# EAGLE design stepper-v1.1 (EAGLE 6.4)
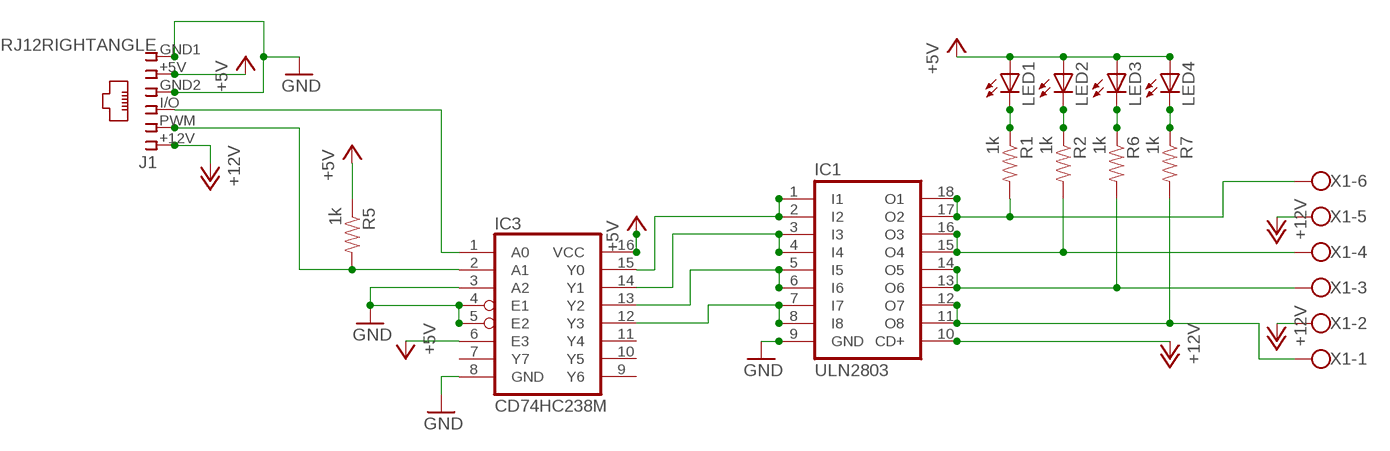
[diagram p0: schematic, sheet 1]

## Parts
IC1  ULN2803  ULN2803A  [SO18W]
IC3  CD74HC238M  74238D  [SO16]
J1  RJ12RIGHTANGLE  [RJ12-RIGHTANGLE]
LED1  LED3MM  [LED3MM]
LED2  LED3MM  [LED3MM]
LED3  LED3MM  [LED3MM]
LED4  LED3MM  [LED3MM]
R1  1k  RESISTOR1206  [1206]
R2  1k  RESISTOR1206  [1206]
R5  1k  RESISTOR1206  [1206]
R6  1k  RESISTOR1206  [1206]
R7  1k  RESISTOR1206  [1206]
X1  W237-6  [W237-6]

## Nets
+5V [power]: IC3.6(E3) IC3.16(VCC) J1.+5V LED1.A LED2.A LED3.A LED4.A R5.1
+12V [power]: IC1.10(CD+) J1.+12V X1.2 X1.5
GND [power]: IC1.9(GND) IC3.3(A2) IC3.4(E1) IC3.5(E2) IC3.8(GND) J1.GND1 J1.GND2
N$1: IC1.1(I1) IC1.2(I2) IC3.15(Y0)
N$2: IC3.2(A1) J1.PWM R5.2
N$3 [power]: IC1.17(O2) IC1.18(O1) R1.2 X1.6
N$4 [power]: IC1.15(O4) IC1.16(O3) R2.2 X1.4
N$5 [power]: IC1.13(O6) IC1.14(O5) R6.2 X1.3
N$6 [power]: IC1.11(O8) IC1.12(O7) R7.2 X1.1
N$7: IC1.7(I7) IC1.8(I8) IC3.12(Y3)
N$8: IC1.3(I3) IC1.4(I4) IC3.14(Y1)
N$9: LED1.K(C) R1.1
N$10: LED2.K(C) R2.1
N$11: LED3.K(C) R6.1
N$12: LED4.K(C) R7.1
N$13: IC3.1(A0) J1.I/O
N$14: IC1.5(I5) IC1.6(I6) IC3.13(Y2)
Unconnected: IC3.7(Y7) IC3.9(Y6) IC3.10(Y5) IC3.11(Y4)

## Library data of the parts
IC1 = lpatiny:ULN2803A: DRIVER ARRAY
IC3 = lpatiny:74*238: 3 to 8 line DECODER/DEMULTIPLEXER
J1 = lpatiny:RJ12: CORCOM Modular RJ Jacks No Shield Source: www.tycoelectronics.com .. ENG_DS_1654001_1099_RJ_L_0507.pdf
LED1-LED4 = lpatiny:LED3MM
R1 R2 R5-R7 = SparkFun:RESISTOR: Resistor Basic schematic elements and footprints for 0603, 1206, and PTH resistors.
X1 = con-wago-500:W237-6: WAGO SCREW CLAMP; OC_FARNELL: unknown; OC_NEWARK: unknown

## Net classes
0 default: width 0.356 mm
1 power: width 0.61 mm

## Board
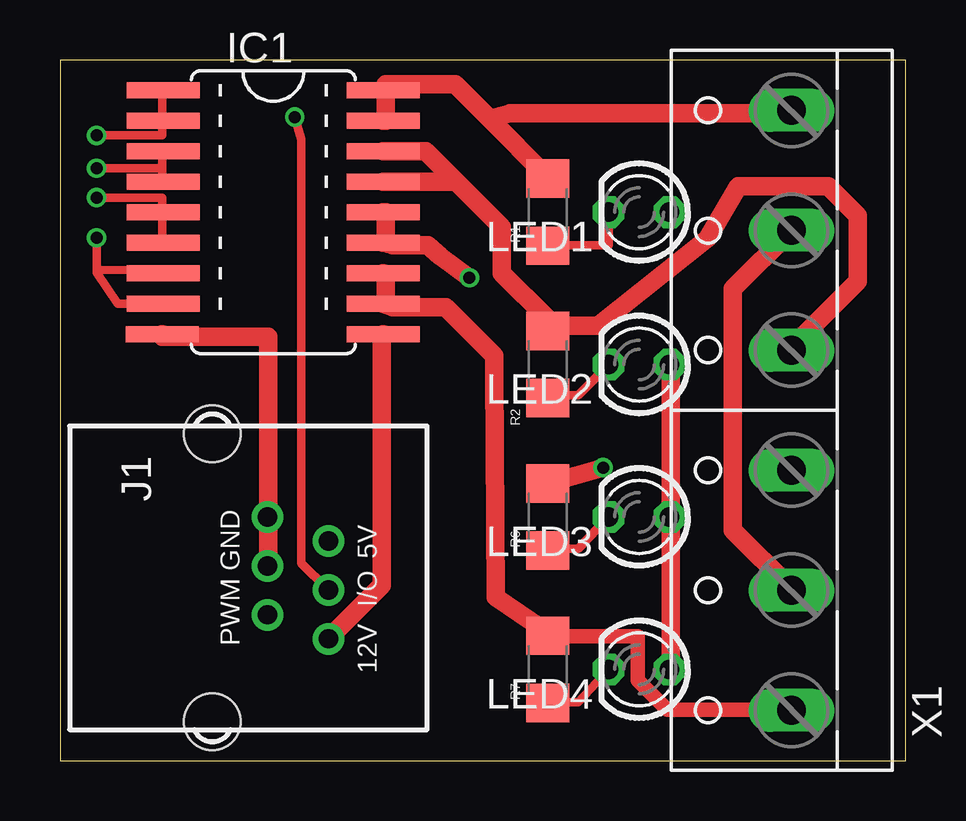
[diagram p1: board, top side]
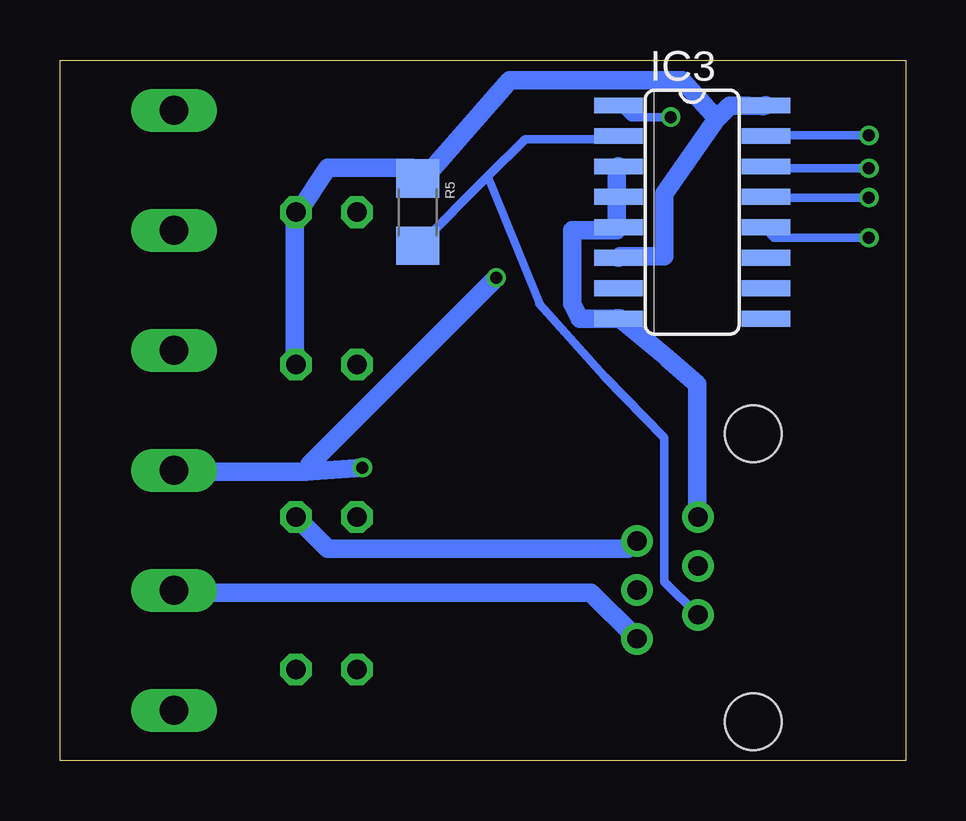
[diagram p2: board, bottom side, seen from below]

Size 35.23 x 29.2 mm. Coordinates in mm from the lower left corner, seen from the top.
Outline: 0,0 35.23,0 35.23,29.2 0,29.2 0,0
Copper layers (1*16): Top 0.035mm / dielectric 1.5mm / Bottom 0.035mm
Design rules "Fusion_eagle_rule_v1.1": minimum track width 6mil, minimum drill 12mil, track to track 6mil, track to pad 6mil, pad to pad 6mil, via to via 6mil, smd to smd 0mil, copper to edge 10mil, drill to drill 10mil, minimum pad ring 10mil, minimum via ring 6mil, stop-mask expansion 2mil, vias tented up to drill 100mil, thermal gap 10mil
vRestrict: area 1.9,15.2 to 8.3,29.2; area 9.5,15.2 to 15.9,29.2

### Footprints (pad centres in the part's own frame; a part is rotated, then mirrored left to right if it is on the bottom)
SO18W = smd 0.66 x 3.048: 1 -5.08,-4.585; 2 -3.81,-4.585; 3 -2.54,-4.585; 4 -1.27,-4.585; 5 0,-4.585; 6 1.27,-4.585; 7 2.54,-4.585; 8 3.81,-4.585; 9 5.08,-4.623; 10 5.08,4.585; 11 3.81,4.585; 12 2.54,4.585; 13 1.27,4.585; 14 0,4.585; 15 -1.27,4.585; 16 -2.54,4.585; 17 -3.81,4.585; 18 -5.08,4.585
SO16 = smd 0.66 x 2.032: 1 -4.445,-3.073; 2 -3.175,-3.073; 3 -1.905,-3.073; 4 -0.635,-3.073; 5 0.635,-3.073; 6 1.905,-3.073; 7 3.175,-3.073; 8 4.445,-3.073; 9 4.445,3.073; 10 3.175,3.073; 11 1.905,3.073; 12 0.635,3.073; 13 -0.635,3.073; 14 -1.905,3.073; 15 -3.175,3.073; 16 -4.445,3.073
RJ12-RIGHTANGLE = drill 0.8 pad 1.3: +5V -1.54,4.84; +12V 2.54,4.84; GND1 -2.54,2.3; GND2 -0.5,2.3; I/O 0.5,4.84; PWM 1.54,2.3 | hole 2.36: -6,0; 6,0
LED3MM = drill 0.813 octagon: A -1.27,0; K 1.27,0
1206 = smd 1.6 x 1.8: 1 -1.4,0; 2 1.4,0
W237-6 = drill 1.194 long: 1 -12.5,-1.27; 2 -7.5,-1.27; 3 -2.5,-1.27; 4 2.5,-1.27; 5 7.5,-1.27; 6 12.5,-1.27

### Placement (x,y rotation side)
IC1  8.89,22.86 270 top
IC3  8.89,22.86 270 bottom
J1  6.35,7.62 270 top
LED1  24.13,22.86 180 top
LED2  24.13,16.51 180 top
LED3  24.13,10.16 180 top
LED4  24.13,3.81 180 top
R1  20.32,22.86 90 top
R2  20.32,16.51 90 top
R5  20.32,22.86 270 bottom
R6  20.32,10.16 90 top
R7  20.32,3.81 90 top
X1  29.21,14.61 90 top

### Tracks (layer width: path | path; a pad name or v marks a point on that pad's centre or on a via)
+5V
  Top 0.762: LED4.A 25.45,3.81 25.45,10.06 LED3.A 25.45,10.52 25.45,16.46 LED2.A
  Bottom 0.762: LED3.A 24.08,8.84 11.58,8.84 11.28,9.14 J1.+5V | 7.86,26.76 10.05,23.62 10.05,21.03 11.89,21.03 IC3.6 | 7.86,26.76 7.33,27.29 6.57,27.29 5.94,27.28 IC3.16 | LED2.A 25.45,16.61 25.45,22.55 LED1.A 25.3,22.86 24.08,24.71 20.57,24.71 20.42,24.23 R5.1 19.96,24.38 16.49,28.36 9.3,28.36 7.86,26.76
+12V
  Top 0.762: J1.+12V 11.28,5.18 13.41,7.32 13.41,17.68 IC1.10 | X1.2 30.48,7.16 28.04,9.6 28.04,19.66 30.48,22.1 X1.5
  Bottom 0.762: J1.+12V 11.28,5.18 13.11,7.01 30.48,7.01 X1.2
GND
  Top 0.762: J1.GND2 8.69,8.23 8.69,10.06 J1.GND1 8.69,10.52 8.69,17.68 4.27,17.68 IC1.9
  Bottom 0.762: 12.04,18.44 IC3.8 | IC3.8 12.34,18.42 12.81,18.43 13.58,18.43 13.88,19.05 13.88,22.1 12.04,22.1 IC3.5 12.04,22.55 12.04,23.47 IC3.4 12.04,23.77 12.04,24.69 IC3.3 | IC3.8 11.92,18.44 9.91,16.76 9.92,16.76 8.69,15.7 8.69,10.21 J1.GND1
N$1  (via drill 0.5)
  Top 0.356: v1.52,26.06 4.27,26.06 4.27,26.67 IC1.2 4.27,26.82 4.27,27.89 IC1.1
  Bottom 0.356: v1.52,26.06 5.79,26.06 IC3.15
N$2
  Bottom 0.356: 17.4,24.36 15.85,25.91 12.04,25.91 IC3.2 | 17.4,24.36 20.27,21.49 R5.2 | 17.4,24.36 15.24,19.05 15.27,19.05 12.54,16 10.06,13.46 10.06,7.47 8.69,6.1 J1.PWM
N$3
  Top 0.762: 17.91,26.75 16.46,28.19 13.56,28.19 13.56,28.04 IC1.18 13.56,27.58 13.56,26.67 IC1.17 | 17.91,26.75 20.27,24.38 R1.2 | 17.91,26.75 18.77,26.98 30.48,26.98 X1.6
N$4
  Top 0.762: X1.4 30.48,17.22 33.24,19.98 33.24,22.71 32,23.94 28.26,23.94 26.99,21.77 22.4,18.14 20.57,18.14 R2.2 20.32,18.41 18.41,20.32 18.41,22.23 16.51,24.13 | 16.51,24.13 IC1.15 | IC1.16 15.24,25.4 16.51,24.13
N$5  (via drill 0.5)
  Top 0.762: IC1.14 13.56,22.86 13.56,21.64 IC1.13 13.87,21.49 15.33,21.49 15.84,21.03 v17.06,20.13 | v22.63,12.22 20.42,11.58 R6.2
  Bottom 0.762: 24.99,12.04 v22.63,12.22 | 24.99,12.04 30.48,12.04 X1.3 | v17.06,20.13 24.84,12.34 24.99,12.04
N$6
  Top 0.61: 20.42,5.18 24.08,5.18 24.08,3.35 25.3,2.13 30.48,2.13
  Top 0.762: IC1.12 13.56,20.27 13.56,19.05 IC1.11 13.87,18.9 16.08,18.9 18.1,16.88 18.1,16.19 18.15,6.82 20.12,5.49 R7.2 20.42,5.18 | 30.48,2.13 X1.1
N$7  (via drill 0.5)
  Top 0.356: IC1.8 2.4,19.05 1.53,20.34 | 1.53,20.34 v1.52,21.79 | IC1.7 4.27,20.27 3.17,20.45 1.52,20.46 1.53,20.34
  Bottom 0.356: v1.52,21.79 5.49,21.79 5.79,22.1 IC3.12
N$8  (via drill 0.5)
  Top 0.356: 4.27,24.69 v1.52,24.69 | 4.27,24.69 4.27,24.23 IC1.4 | 4.27,24.69 4.27,25.3 IC1.3
  Bottom 0.356: v1.52,24.69 5.79,24.69 IC3.14
N$9
  Top 0.356: LED1.K 22.86,21.49 20.42,21.49 R1.1
N$10
  Top 0.356: LED2.K 21.59,15.24 20.42,15.24 R2.1
N$11
  Top 0.356: LED3.K 21.59,8.84 20.42,8.84 R6.1
N$12
  Top 0.356: LED4.K 21.59,2.44 20.42,2.44 R7.1
N$13  (via drill 0.5)
  Top 0.356: v9.78,26.82 10.06,25.91 10.06,8.23 11.12,7.16 J1.I/O
  Bottom 0.356: v9.78,26.82 11.43,26.82 11.89,27.28 IC3.1
N$14  (via drill 0.5)
  Top 0.356: v1.52,23.47 4.27,23.47 4.27,22.86 IC1.5 4.27,22.71 4.27,21.64 IC1.6
  Bottom 0.356: v1.52,23.47 5.79,23.47 IC3.13

### Text on the board
tDocu: Stepper 1.1 - 12V